# EAGLE design CP2104 USB to UART (EAGLE 9.6.2)
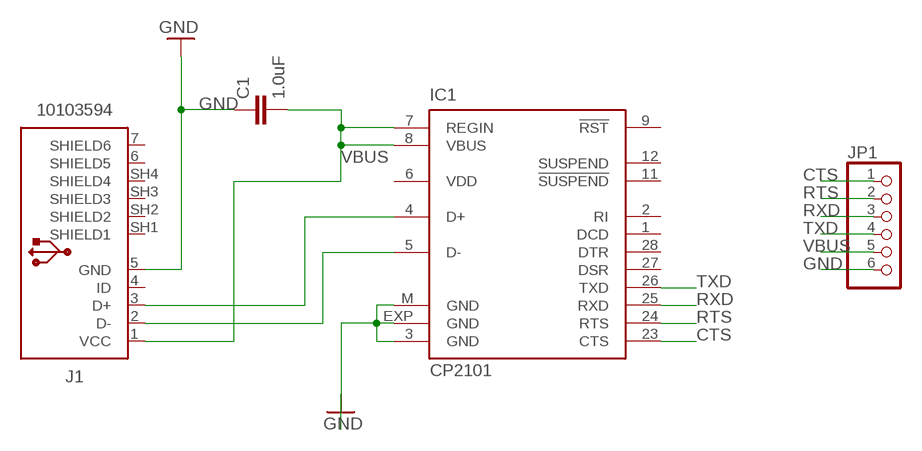
[diagram p0: schematic, sheet 1]

## Parts
C1  1.0uF  1.0UF-0805-25V-(+80/-20%)  [0805]
IC1  CP2101  [MLP28]
J1  10103594  [10103594]
JP1  PINHD-1X6  [1X06]

## Nets
CTS: IC1.23(CTS) JP1.1
GND: C1.1 IC1.3(GND) IC1.EXP(GND) IC1.M(GND) J1.5(GND) JP1.6
N$1: IC1.4(D+) J1.3(D+)
N$2: IC1.5(D-) J1.2(D-)
RTS: IC1.24(RTS) JP1.2
RXD: IC1.25(RXD) JP1.3
TXD: IC1.26(TXD) JP1.4
VBUS: C1.2 IC1.7(REGIN) IC1.8(VBUS) J1.1(VCC) JP1.5
Unconnected: IC1.1(DCD) IC1.2(RI) IC1.9(!RST) IC1.11(!SUSPEND) IC1.12(SUSPEND) IC1.27(DSR) IC1.28(DTR) J1.4(ID) J1.6(SHIELD5) J1.7(SHIELD6) J1.SH1(SHIELD1) J1.SH2(SHIELD2) J1.SH3(SHIELD3) J1.SH4(SHIELD4)

## Power pins joined to a net without a drawn wire
VDD: IC1.6(VDD)

## Library data of the parts
C1 = SparkFun-Capacitors:1.0UF: 1µF ceramic capacitors A capacitor is a passive two-terminal electrical component used to store electrical energy temporarily in an electric field.; PROD_ID: CAP-11625
IC1 = silabs:CP210*: Single-Chip USB to UART Bridge Source: www.silabs.com .. CP2101.pdf / cp2102.pdf; MF: FARNELL; MPN: CP2102-GM; OC_FARNELL: 9282130; OC_NEWARK: 30K5635
J1 = Connector_USB:10103594: USB(2.0) Micro-B, RCPT, 5POS, SMD-THT-R/A Datasheet <https://cdn.amphenol-icc.com/media/wysiwyg/files/documentation/datasheet/inputoutput/io_usb_micro.pdf> Drawing <https://cdn.amphenol-icc.com/media/wysiwyg/files/drawing/10103594.pdf>; CATEGORY: Connectors; CONTACTS: 5; CURRENT-RATING: 1.8A; DESCRIPTION: CONN RCPT USB2.0 MICRO B SMD R/A; GENDER: Receptacle; MANUFACTURER: Amphenol ICC (FCI); MOUNT_TYPE: R/A; MPN: 10103594-0001LF; OPERATING_TEMPERATURE: -30°C ~ 80°C; PART_STATUS: ACTIVE; ROHS_COMPLIANT: COMPLIANT; SUB_CATEGORY: USB; TYPE: USB-micro B; VOLTAGE-RATING: 100VAC
JP1 = pinhead:PINHD-1X6: PIN HEADER

## Board
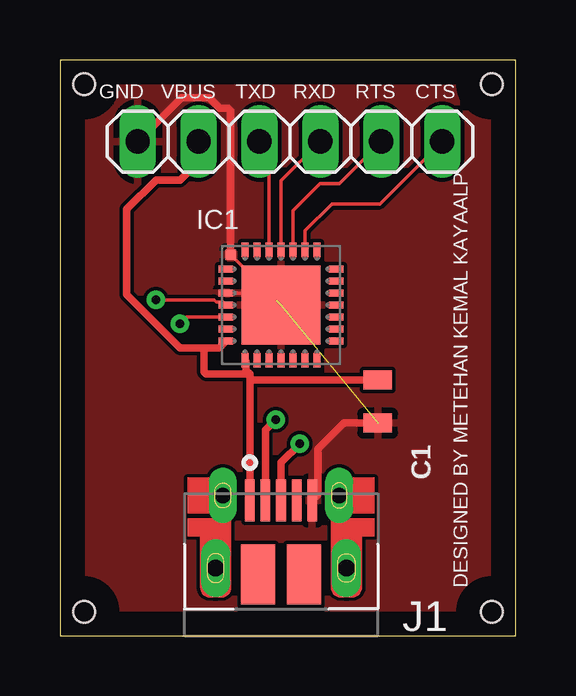
[diagram p1: board, top side]
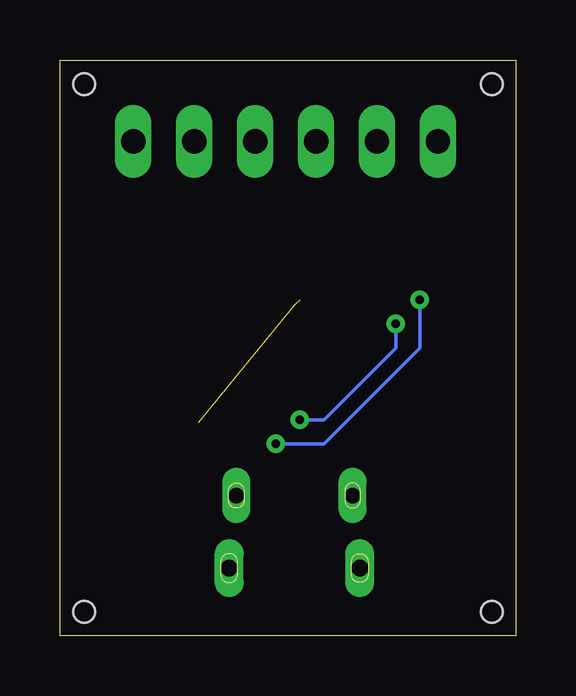
[diagram p2: board, bottom side, seen from below]

Size 19 x 24 mm. Coordinates in mm from the lower left corner, seen from the top.
Outline: 0,0 19,0 19,24 0,24 0,0
Copper layers (1*16): Top 0.035mm / dielectric 1.5mm / Bottom 0.035mm
Design rules "default": minimum track width 6mil, minimum drill 0.35mm, track to track 6mil, track to pad 6mil, pad to pad 6mil, via to via 6mil, smd to smd 6mil, copper to edge 40mil, drill to drill 6mil, minimum pad ring 10mil, minimum via ring 8mil, stop-mask expansion 4mil, vias tented up to drill 0mil, thermal gap 10mil
Holes 0.9 mm at 1,1 18,1 1,23 18,23

### Footprints (pad centres in the part's own frame; a part is rotated, then mirrored left to right if it is on the bottom)
0805 = smd 0.8 x 1.2: 1 -0.9,0; 2 0.9,0
MLP28 = smd 0.6 x 0.3: 1 -2.3,1.5; 2 -2.3,1; 3 -2.3,0.5; 4 -2.3,0; 5 -2.3,-0.5; 6 -2.3,-1; 7 -2.3,-1.5; 15 2.3,-1.5; 16 2.3,-1; 17 2.3,-0.5; 18 2.3,0; 19 2.3,0.5; 20 2.3,1; 21 2.3,1.5 | smd 0.3 x 0.6: 8 -1.5,-2.3; 9 -1,-2.3; 10 -0.5,-2.3; 11 0,-2.3; 12 0.5,-2.3; 13 1,-2.3; 14 1.5,-2.3; 22 1.5,2.3; 23 1,2.3; 24 0.5,2.3; 25 0,2.3; 26 -0.5,2.3; 27 -1,2.3; 28 -1.5,2.3 | smd 3.3 x 3.3: EXP 0,0 | smd 0.435 x 0.435: M -2.103,2.103
10103594 = smd 0.4 x 1.75: 1 -1.3,2.825; 2 -0.65,2.825; 3 0,2.825; 4 0.65,2.825; 5 1.3,2.825 | smd 1.425 x 2.5: 6 -0.963,-0.25; 7 0.963,-0.25 | drill 0.65 pad 0.73 long: SH1 -2.425,3.03; SH2 2.425,3.03 | drill 0.7 long: SH3 -2.725,0; SH4 2.725,0
1X06 = drill 1.016 long: 1 -6.35,0; 2 -3.81,0; 3 -1.27,0; 4 1.27,0; 5 3.81,0; 6 6.35,0

### Placement (x,y rotation side)
C1  13.25,9.76 90 top
IC1  9.22,13.78 0 top
J1  9.22,2.81 0 top
JP1  9.59,20.6 180 top

### Tracks (layer width: path | path; a pad name or v marks a point on that pad's centre or on a via)
CTS
  Top 0.152: JP1.1 13.34,18 11.34,18 10.22,16.88 IC1.23
GND  (2 unrouted)
  Top 0.152: 7.28,14.28 7,14.28 | IC1.3 8.72,14.28 | 8.72,14.28 9,14 | 8.72,14.28 IC1.M
  Top 0.2: IC1.3 7,14.28 | 9.23,14.28 9.22,14.27 IC1.EXP
  Top 0.305: C1.1 11.84,8.86 10.76,7.79 10.76,5.88 J1.5 | JP1.6 5.07,22.43 6.22,22.43 6.65,22 7,22 7.12,21.88 IC1.M
  pour Top: -3,29 23,29 23,-1 -4,-1 -4,29
N$1  (via drill 0.35)
  Top 0.152: v4,14 6.43,14 6.53,13.9 6.8,13.9 IC1.4
  Top 0.305: J1.3 9.22,7.22 v10,8
  Bottom 0.152: v10,8 8,8 4,12 v4,14
N$2  (via drill 0.35)
  Top 0.152: v5,13 5.28,13.28 IC1.5
  Top 0.305: J1.2 8.57,8.57 v9,9
  Bottom 0.152: v9,9 8,9 5,12 v5,13
RTS
  Top 0.152: JP1.2 11.65,18.85 10.85,18.85 9.72,17.72 IC1.24
RXD
  Top 0.152: JP1.3 9.22,18.96 9.22,18 9.22,17.87 IC1.25
TXD
  Top 0.152: JP1.4 8.72,20.2 IC1.26
VBUS
  Top 0.305: 7.92,10.66 C1.2 | 6,12 6,11 6.1,10.9 7.92,10.9 | 6,12 5,12 2.78,14.22 2.78,17.78 4,19 5,19 5.78,19.78 JP1.5 | IC1.7 6.64,12 6,12 | J1.1 7.92,10.66 | IC1.8 7.77,11.44 7.77,11.05 7.92,10.9 | 7.92,10.9 7.92,10.66

### Text on the board
tNames: GND | VBUS | TXD | RXD | RTS | CTS | DESIGNED BY METEHAN KEMAL KAYAALP